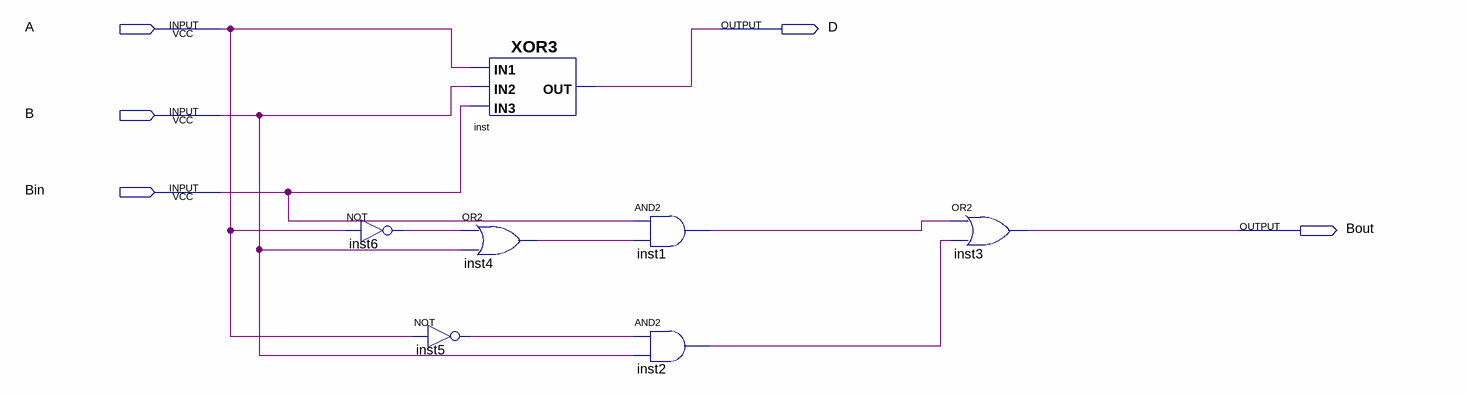
[diagram p0: schematic sheet]
// Quartus schematic subtratorCompleto.bdf as structural Verilog: 7 symbols, 5 pins
module subtratorCompleto (
  input  A,
  input  B,
  input  Bin,
  output D,
  output Bout
);

  wire inst1_out, inst2_out, inst4_out, inst5_out, inst6_out;

  not inst6 (inst6_out, A);
  XOR3 inst (.IN3(Bin), .IN1(A), .IN2(B), .OUT(D));
  or inst4 (inst4_out, inst6_out, B);
  not inst5 (inst5_out, A);
  and inst1 (inst1_out, Bin, inst4_out);
  and inst2 (inst2_out, inst5_out, B);
  or inst3 (Bout, inst1_out, inst2_out);
endmodule
